# EAGLE design control_bat (EAGLE 6.5.0)
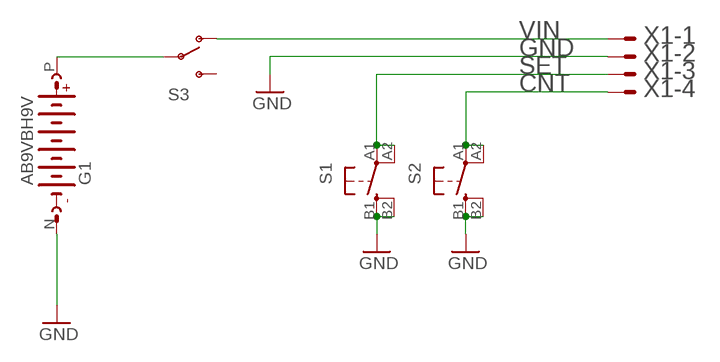
[diagram p0: schematic, sheet 1]

## Parts
G1  AB9VBH9V  [BH9V-PC-ND]
S1  TAC_SWITCHD6F  [D6F]
S2  TAC_SWITCHD6F  [D6F]
S3  SWITCH-SPST  [EG1270]
X1  DF13-4P-1.25V(50)  53398-04  [53398-04]

## Nets
CNT: S2.A1 S2.A2 X1.4
GND: G1.N(-) S1.B1 S1.B2 S2.B1 S2.B2 X1.2
N$4: G1.P(+) S3.P$2(P)
SET: S1.A1 S1.A2 X1.3
VIN: S3.P$1(O) X1.1
Unconnected: S3.P$3(S)

## Library data of the parts
G1 = joe:AB9V: 9-V BATTERY CLIP
S1 S2 = torpedo:TAC_SWITCH: Momentary Switch Button commonly used for reset or general input. Spark Fun Electronics SKU : COM-00097
S3 = torpedo:SWITCH-SPST: SPST Switch Simple slide switch. Spark Fun Electronics SKU : COM-00102
X1 = con-molex:53?-04: CONNECTOR wire to board 1.25 mm (.049 inch) pitch header; OC_FARNELL: 1125367; OC_NEWARK: unknown

## Net classes
1 PWR: width 0.254 mm, drill 0.406 mm

## Board
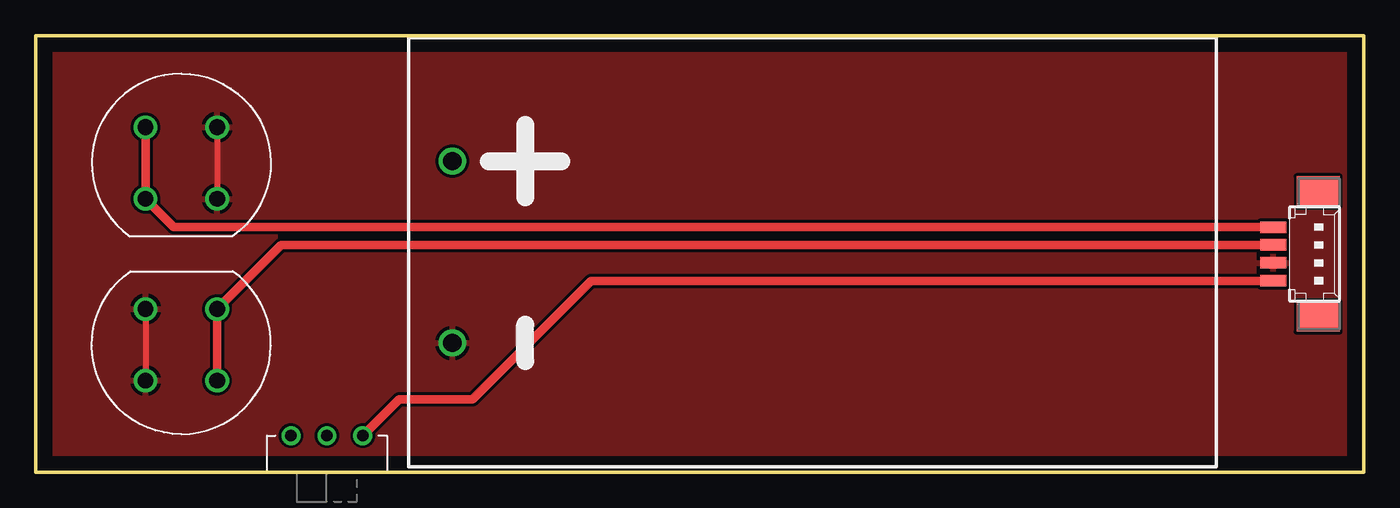
[diagram p1: board, top side]
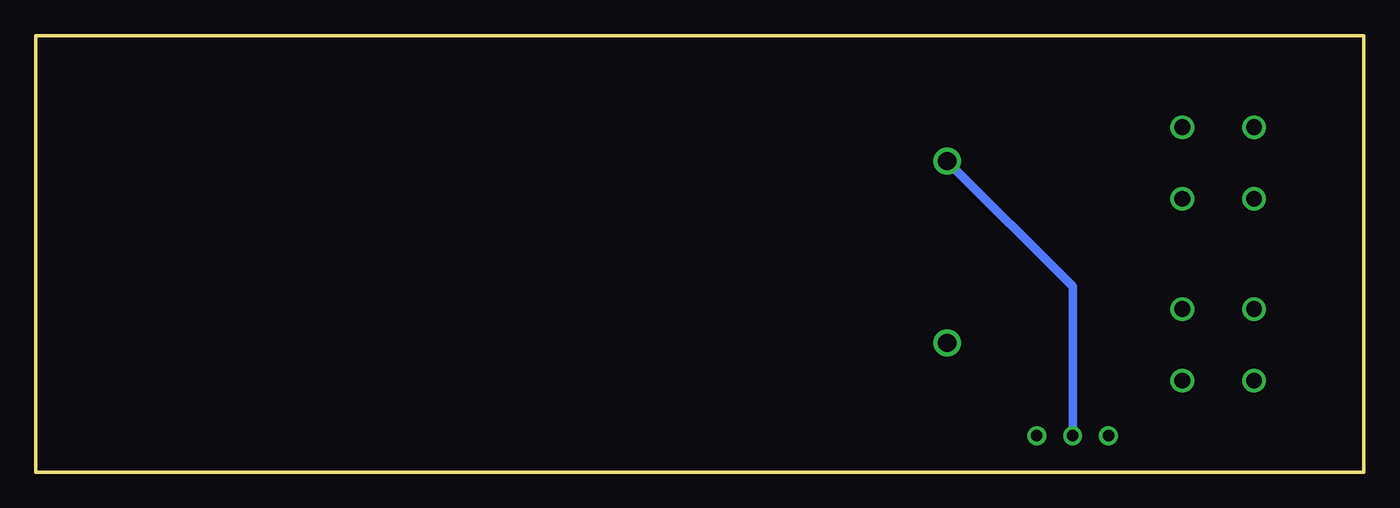
[diagram p2: board, bottom side, seen from below]

Size 92.71 x 30.48 mm. Coordinates in mm from the lower left corner, seen from the top.
Outline: 0,0 92.71,0 92.71,30.48 0,30.48 0,0
Copper layers (1*16): Top 0.035mm / dielectric 1.5mm / Bottom 0.035mm
Design rules "default": minimum track width 10mil, minimum drill 24mil, track to track 8mil, track to pad 8mil, pad to pad 8mil, via to via 8mil, smd to smd 8mil, copper to edge 40mil, drill to drill 8mil, minimum pad ring 10mil, minimum via ring 8mil, stop-mask expansion 4mil, vias tented up to drill 0mil, thermal gap 10mil

### Footprints (pad centres in the part's own frame; a part is rotated, then mirrored left to right if it is on the bottom)
BH9V-PC-ND = drill 1.27: N 8.64,-3.05; P 21.34,-3.05
D6F = drill 1.1: A1 2.5,2.5; A2 -2.5,2.5; B1 2.5,-2.5; B2 -2.5,-2.5
EG1270 = drill 0.8: P$1 0,2.5; P$2 0,0; P$3 0,-2.5
53398-04 = smd 0.8 x 1.8: 1 1.875,-2.5; 2 0.625,-2.5; 3 -0.625,-2.5; 4 -1.875,-2.5 | smd 2.1 x 3: S1 4.375,0.625; S2 -4.375,0.625

### Placement (x,y rotation side)
G1  26.04,0.38 90 top
S1  10.16,8.89 270 top
S2  10.16,21.59 90 top
S3  20.32,2.54 270 top
X1  88.9,15.24 270 top

### Tracks (layer width: path | path; a pad name or v marks a point on that pad's centre or on a via)
CNT
  Top 0.61: S2.A1 S2.A2 9.63,17.11 X1.4
GND
  Top 0.406: S2.B1 S2.B2 | S1.B2 S1.B1
  pour Top: 0,30.48 92.71,30.48 92.71,0 0,0
N$4
  Bottom 0.61: G1.P 20.32,12.96 S3.P$2
SET
  Top 0.61: S1.A1 S1.A2 17.14,15.87 X1.3
VIN
  Top 0.61: S3.P$1 25.36,5.08 30.48,5.08 38.77,13.37 X1.1